# EAGLE schematic Splitter (EAGLE 9.0.1)
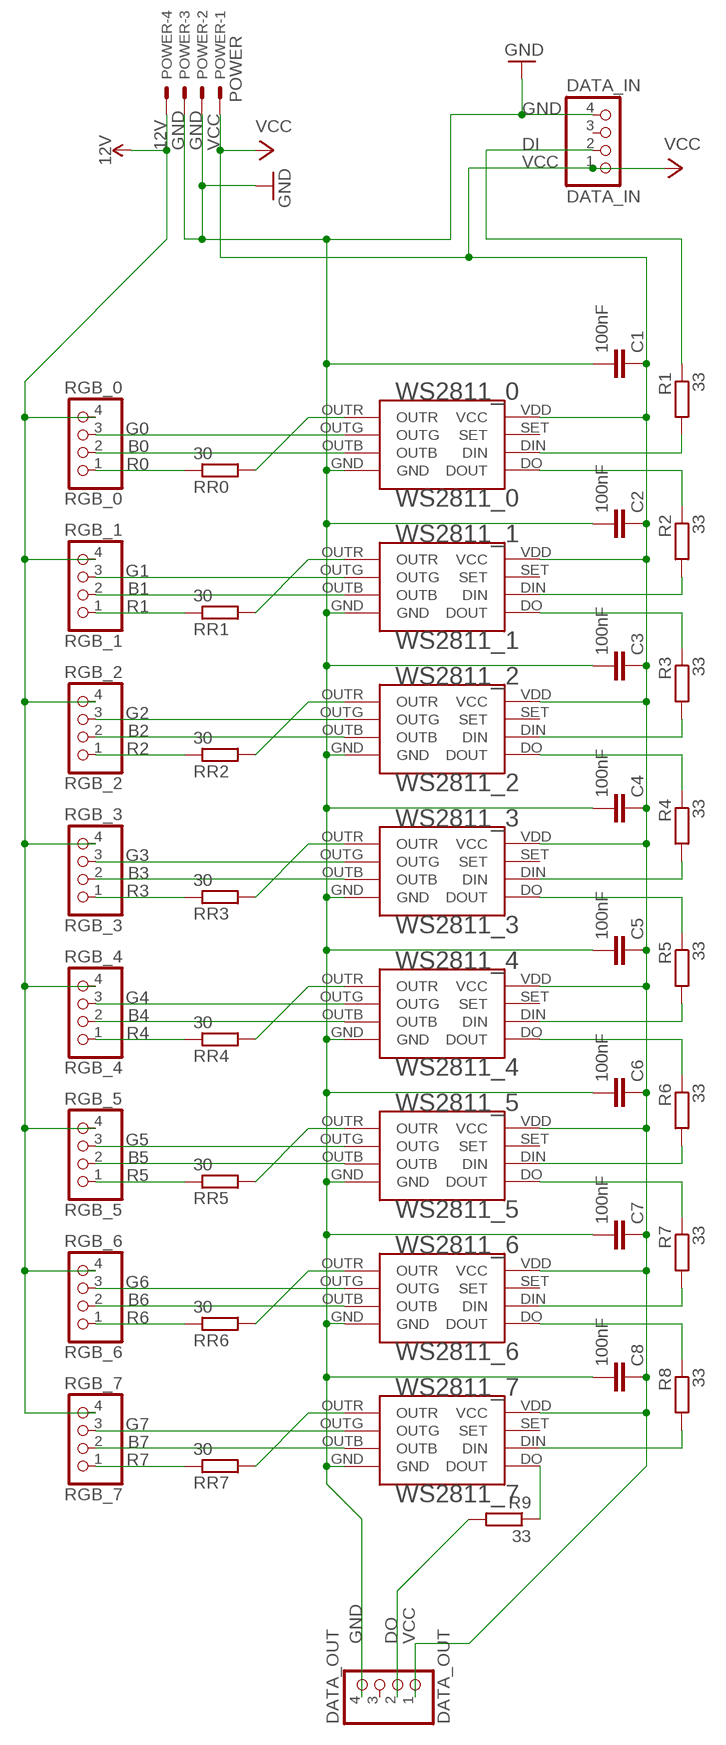
[diagram p0: schematic, sheet 1]

## Parts
C1  100nF  C  [C0805]
C2  100nF  C  [C0805]
C3  100nF  C  [C0805]
C4  100nF  C  [C0805]
C5  100nF  C  [C0805]
C6  100nF  C  [C0805]
C7  100nF  C  [C0805]
C8  100nF  C  [C0805]
DATA_IN  DATA_IN  PINHD-1X4  [1X04]
DATA_OUT  DATA_OUT  PINHD-1X4  [1X04]
POWER  POWER  KK-156-4  [KK-156-4]
R1  33  R-EU_0204/5  [0204/5]
R2  33  R-EU_0204/5  [0204/5]
R3  33  R-EU_0204/5  [0204/5]
R4  33  R-EU_0204/5  [0204/5]
R5  33  R-EU_0204/5  [0204/5]
R6  33  R-EU_0204/5  [0204/5]
R7  33  R-EU_0204/5  [0204/5]
R8  33  R-EU_0204/5  [0204/5]
R9  33  R-EU_0204/5  [0204/5]
RGB_0  RGB_0  PINHD-1X4  [1X04]
RGB_1  RGB_1  PINHD-1X4  [1X04]
RGB_2  RGB_2  PINHD-1X4  [1X04]
RGB_3  RGB_3  PINHD-1X4  [1X04]
RGB_4  RGB_4  PINHD-1X4  [1X04]
RGB_5  RGB_5  PINHD-1X4  [1X04]
RGB_6  RGB_6  PINHD-1X4  [1X04]
RGB_7  RGB_7  PINHD-1X4  [1X04]
RR0  30  R-EU_0204/5  [0204/5]
RR1  30  R-EU_0204/5  [0204/5]
RR2  30  R-EU_0204/5  [0204/5]
RR3  30  R-EU_0204/5  [0204/5]
RR4  30  R-EU_0204/5  [0204/5]
RR5  30  R-EU_0204/5  [0204/5]
RR6  30  R-EU_0204/5  [0204/5]
RR7  30  R-EU_0204/5  [0204/5]
WS2811_0  WS2811_0  WS2811  [WS2811]
WS2811_1  WS2811_1  WS2811  [WS2811]
WS2811_2  WS2811_2  WS2811  [WS2811]
WS2811_3  WS2811_3  WS2811  [WS2811]
WS2811_4  WS2811_4  WS2811  [WS2811]
WS2811_5  WS2811_5  WS2811  [WS2811]
WS2811_6  WS2811_6  WS2811  [WS2811]
WS2811_7  WS2811_7  WS2811  [WS2811]

## Nets
12V: POWER.4 RGB_0.4 RGB_1.4 RGB_2.4 RGB_3.4 RGB_4.4 RGB_5.4 RGB_6.4 RGB_7.4
+5V: R8.2 WS2811_7.DIN
B0: RGB_0.2 WS2811_0.OUTB
B1: RGB_1.2 WS2811_1.OUTB
B2: RGB_2.2 WS2811_2.OUTB
B3: RGB_3.2 WS2811_3.OUTB
B4: RGB_4.2 WS2811_4.OUTB
B5: RGB_5.2 WS2811_5.OUTB
B6: RGB_6.2 WS2811_6.OUTB
B7: RGB_7.2 WS2811_7.OUTB
DI: DATA_IN.2 R1.1
DO: DATA_OUT.2 R9.2
G0: RGB_0.3 WS2811_0.OUTG
G1: RGB_1.3 WS2811_1.OUTG
G2: RGB_2.3 WS2811_2.OUTG
G3: RGB_3.3 WS2811_3.OUTG
G4: RGB_4.3 WS2811_4.OUTG
G5: RGB_5.3 WS2811_5.OUTG
G6: RGB_6.3 WS2811_6.OUTG
G7: RGB_7.3 WS2811_7.OUTG
GND: C1.2 C2.2 C3.2 C4.2 C5.2 C6.2 C7.2 C8.2 DATA_IN.4 DATA_OUT.4 POWER.2 POWER.3 WS2811_0.GND WS2811_1.GND WS2811_2.GND WS2811_3.GND WS2811_4.GND WS2811_5.GND WS2811_6.GND WS2811_7.GND
N$1: RR0.2 WS2811_0.OUTR
N$2: R1.2 WS2811_0.DIN
N$3: R9.1 WS2811_7.DO(DOUT)
N$4: R2.1 WS2811_0.DO(DOUT)
N$5: R3.1 WS2811_1.DO(DOUT)
N$6: R2.2 WS2811_1.DIN
N$7: RR1.2 WS2811_1.OUTR
N$8: R4.1 WS2811_2.DO(DOUT)
N$9: R6.1 WS2811_4.DO(DOUT)
N$10: R3.2 WS2811_2.DIN
N$11: RR2.2 WS2811_2.OUTR
N$12: R7.1 WS2811_5.DO(DOUT)
N$13: R8.1 WS2811_6.DO(DOUT)
N$14: R4.2 WS2811_3.DIN
N$15: RR3.2 WS2811_3.OUTR
N$16: R5.1 WS2811_3.DO(DOUT)
N$17: RR4.2 WS2811_4.OUTR
N$18: R5.2 WS2811_4.DIN
N$19: RR5.2 WS2811_5.OUTR
N$20: RR6.2 WS2811_6.OUTR
N$21: RR7.2 WS2811_7.OUTR
N$22: R6.2 WS2811_5.DIN
N$26: R7.2 WS2811_6.DIN
R0: RGB_0.1 RR0.1
R1: RGB_1.1 RR1.1
R2: RGB_2.1 RR2.1
R3: RGB_3.1 RR3.1
R4: RGB_4.1 RR4.1
R5: RGB_5.1 RR5.1
R6: RGB_6.1 RR6.1
R7: RGB_7.1 RR7.1
VCC: C1.1 C2.1 C3.1 C4.1 C5.1 C6.1 C7.1 C8.1 DATA_IN.1 DATA_OUT.1 POWER.1 WS2811_0.VDD(VCC) WS2811_1.VDD(VCC) WS2811_2.VDD(VCC) WS2811_3.VDD(VCC) WS2811_4.VDD(VCC) WS2811_5.VDD(VCC) WS2811_6.VDD(VCC) WS2811_7.VDD(VCC)
Unconnected: DATA_IN.3 DATA_OUT.3 WS2811_0.SET WS2811_1.SET WS2811_2.SET WS2811_3.SET WS2811_4.SET WS2811_5.SET WS2811_6.SET WS2811_7.SET

## Library data of the parts
C1-C8 = eagle-ltspice:C: CAPACITOR, European symbol; SPICEMODEL: NONE; SPICEPREFIX: C
DATA_IN DATA_OUT RGB_0 RGB_1-RGB_7 = pinhead:PINHD-1X4: PIN HEADER
POWER = con-molex:KK-156-4: KK 156 HEADER Source: http://www.molex.com/pdm_docs/sd/026604100_sd.pdf; MF: MOLEX; OC_FARNELL: unknown; OC_NEWARK: unknown
R1-R9 RR0 RR1-RR7 = resistor:R-EU_: RESISTOR, European symbol
WS2811_0 WS2811_1-WS2811_7 = WS2811:WS2811: WS2811 DIP8

## Net classes
0 default: width 0.254 mm, clearance 0.127 mm